# EAGLE design esp8285-programmer-v1.0 (EAGLE 7.5.0)
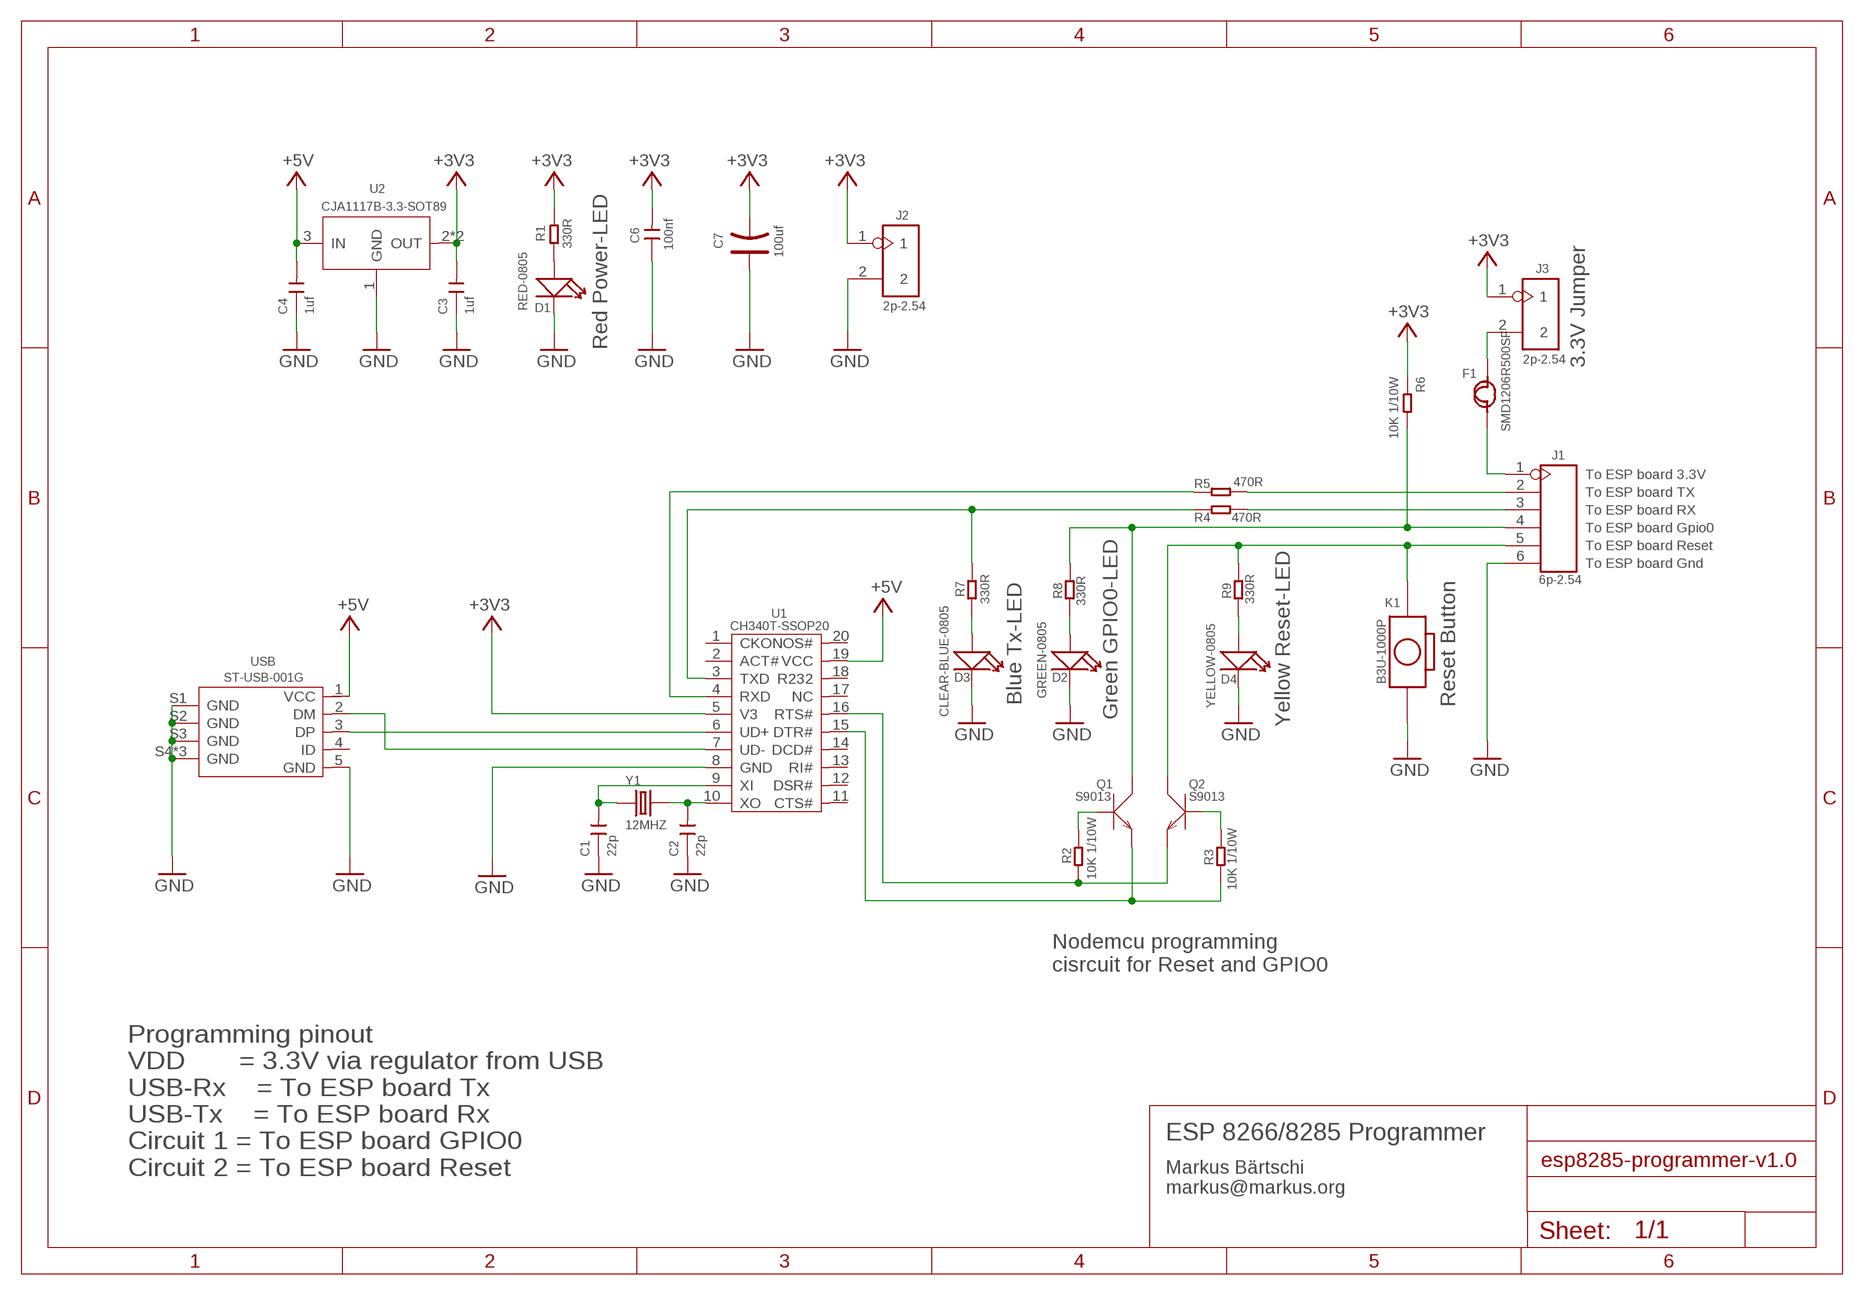
[diagram p0: schematic, sheet 1]

## Parts
C1  22p  CERAMIC-10PF-50V-5%-NPO(0603)  [C0603]
C2  22p  CERAMIC-10PF-50V-5%-NPO(0603)  [C0603]
C3  1uf  CERAMIC-1UF-25V-10%-X7R(0603)  [C0603]
C4  1uf  CERAMIC-1UF-25V-10%-X7R(0603)  [C0603]
C6  100nf  CERAMIC-100NF-50V-10%-X7R(0603)  [C0603]
C7  100uf  TANTALUM-SMD-100UF-6.3V(AVX-B)  [AVX-B]
D1  RED-0805  SMD-LED-CLEAR-RED(0805)  [LED-0805]
D2  GREEN-0805  SMD-LED-CLEAR-GREEN(0805)  [LED-0805]
D3  CLEAR-BLUE-0805  SMD-LED-CLEAR-BLUE(0805)  [LED-0805]
D4  YELLOW-0805  SMD-LED-CLEAR-YELLOW(0805)  [LED-0805]
F1  SMD1206R500SF  SMD-PPTC-500MA(1206)  [F1206]
J1  6p-2.54  DIP-BLACK-MALE-HEADER(6P-2.54)  [H6-2.54]
J2  2p-2.54  DIP-BLACK-MALE-HEADER-VERT(2P-2.54)  [H2-2.54]
J3  2p-2.54  DIP-BLACK-MALE-HEADER-VERT(2P-2.54)  [H2-2.54]
K1  B3U-1000P  SMD-BUTTON-WITHOUT-BOSS-(2P-3X2.5MM)  [SW2-SMD-3.0X2.5X1.2+0.4MM]
Q1  S9013  SMD-TRANSISTORS-NPN-25V-500MA-S9013(SOT-23)  [SOT-23]
Q2  S9013  SMD-TRANSISTORS-NPN-25V-500MA-S9013(SOT-23)  [SOT-23]
R1  330R  SMD-RES-330R-1%-1/10W(0603)  [R0603]
R2  10K 1/10W  SMD-RES-10K-5%-1/10W(0603)  [R0603]
R3  10K 1/10W  SMD-RES-10K-5%-1/10W(0603)  [R0603]
R4  470R  SMD-RES-470R-5%-1/10W(0603)  [R0603]
R5  470R  SMD-RES-470R-5%-1/10W(0603)  [R0603]
R6  10K 1/10W  SMD-RES-10K-5%-1/10W(0603)  [R0603]
R7  330R  SMD-RES-330R-1%-1/10W(0603)  [R0603]
R8  330R  SMD-RES-330R-1%-1/10W(0603)  [R0603]
R9  330R  SMD-RES-330R-1%-1/10W(0603)  [R0603]
U1  CH340T-SSOP20  INTERFACE-CH340T(SSOP20)  [SSOP20-0.65-7.6X5.2MM]
U2  CJA1117B-3.3-SOT89  PMIC-CJA1117B-3.3(SOT-89)  [SOT-89]
USB  ST-USB-001G  MICRO-USB-SMD-B-WITHOUT-POST-W/P(ST-USB-001G)  [MICRO-USB5+4P-SMD-0.65-B]
Y1  12MHZ  SMD-CRYSTAL-12MHZ-20PF-20PPM-40R(2P-5.0X3.2MM)  [X2-SMD-5.0X3.2X1.3MM]

## Nets
+3V3: C3.2 C6.2 C7.- J2.1 J3.1 R1.2 R6.1 U1.5(V3) U2.2(OUT) U2.4(OUT)
+5V: C4.2 U1.19(VCC) U2.3(IN) USB.1(VCC)
GND: C1.1 C2.1 C3.1 C4.1 C6.1 C7.+ D1.- D2.- D3.- D4.- J1.6 J2.2 K1.1 U1.8(GND) U2.1(GND) USB.5(GND) USB.S1(GND) USB.S2(GND) USB.S3(GND) USB.S4(GND) USB.S5(GND) USB.S6(GND)
N$1: F1.1 J1.1
N$2: D1.+ R1.1
N$3: F1.2 J3.2
N$4: J1.2 R5.2
N$5: C2.2 U1.10(XO) Y1.2
N$6: C1.2 U1.9(XI) Y1.1
N$7: J1.3 R4.2
N$8: Q1.1(B) R2.1
N$9: Q2.1(B) R3.1
N$17: D3.+ R7.1
N$18: D2.+ R8.1
N$19: D4.+ R9.1
N$DTR: Q1.2(E) R3.2 U1.15(DTR#)
N$GPIO0: J1.4 Q1.3(C) R6.2 R8.2
N$RESET: J1.5 K1.2 Q2.3(C) R9.2
N$RTS: Q2.2(E) R2.2 U1.16(RTS#)
N$RX: R5.1 U1.4(RXD)
N$TX: R4.1 R7.2 U1.3(TXD)
N$USBD+: U1.6(UD+) USB.3(DP)
N$USBD-: U1.7(UD-) USB.2(DM)
Unconnected: U1.1(CKO) U1.2(ACT#) U1.11(CTS#) U1.12(DSR#) U1.13(RI#) U1.14(DCD#) U1.17(NC) U1.18(R232) U1.20(NOS#) USB.4(ID)

## Notes on the sheet
- Red Power-LED
- 3.3V Jumper
- To ESP board 3.3V
- To ESP board TX
- To ESP board RX
- To ESP board Gpio0
- To ESP board Reset
- To ESP board Gnd
- Blue Tx-LED | Reset Button
- Green GPIO0-LED
- Yellow Reset-LED
- Nodemcu programming
  cisrcuit for Reset and GPIO0
- ESP 8266/8285 Programmer
- Markus Bärtschi
  markus@markus.org
- Programming pinout
  VDD       = 3.3V via regulator from USB
  USB-Rx    = To ESP board Tx
  USB-Tx    = To ESP board Rx
  Circuit 1 = To ESP board GPIO0
  Circuit 2 = To ESP board Reset

## Library data of the parts
C1 C2 = Seeed-OPL-Capacitor:CERAMIC-10PF-50V-5%-NPO(0603): 302010097; VALUE: 10pf
C3 C4 = Seeed-OPL-Capacitor:CERAMIC-1UF-25V-10%-X7R(0603): 302010139; MPN: CC0603KRX7R8BB105
C6 = Seeed-OPL-Capacitor:CERAMIC-100NF-50V-10%-X7R(0603): 302010138; MPN: CC0603KRX7R9BB104
C7 = Seeed-OPL-Capacitor:TANTALUM-SMD-100UF-6.3V(AVX-B): 302020017; MPN: TAJB107M006RNJ
D1 = Seeed-OPL-Diode:SMD-LED-CLEAR-RED(0805): 304090046; MPN: 17-215SURC/S530-A2/TR8
D2 = Seeed-OPL-Diode:SMD-LED-CLEAR-GREEN(0805): 304090057; MPN: 17-215SYGC/S530-E2/TR8
D3 = Seeed-OPL-Diode:SMD-LED-CLEAR-BLUE(0805): 304090061; MPN: EL-17-215/BHC-AN1P2/3T
D4 = Seeed-OPL-Diode:SMD-LED-CLEAR-YELLOW(0805): 304090039; MPN: 17-215UYC/S530-A3/TR8
F1 = Seeed-OPL-fuse:SMD-PPTC-500MA(1206): 307010002; MPN: SMD1206R500SF
J1 = Seeed-OPL-Connector:DIP-BLACK-MALE-HEADER(6P-2.54): 320020078; MPN: P125-1106A1BS116A1
J2 J3 = Seeed-OPL-Connector:DIP-BLACK-MALE-HEADER-VERT(2P-2.54): 320020016; MPN: P125-1102A0BS116A1
K1 = Seeed-OPL-Button:SMD-BUTTON-WITHOUT-BOSS-(2P-3X2.5MM): 311020047; MPN: B3U-1000P
Q1 Q2 = Seeed-OPL-Transistor:SMD-TRANSISTORS-NPN-25V-500MA-S9013(SOT-23): 305010018; MPN: S9013
R1 R7-R9 = Seeed-OPL-Resistor:SMD-RES-330R-1%-1/10W(0603): 301010300; MPN: RC0603FR-07330RL
R2 R3 R6 = Seeed-OPL-Resistor:SMD-RES-10K-5%-1/10W(0603): 301010293; MPN: RC0603JR-0710KL
R4 R5 = Seeed-OPL-Resistor:SMD-RES-470R-5%-1/10W(0603): 301010088; MPN: RC0603JR-07470RL
U1 = Seeed-OPL-ic:INTERFACE-CH340T(SSOP20): 310070026; MPN: CH340T
U2 = Seeed-OPL-ic:PMIC-CJA1117B-3.3(SOT-89): 310030095; MPN: CJA1117B-3.3
USB = Seeed-OPL-Connector:MICRO-USB-SMD-B-WITHOUT-POST-W/P(ST-USB-001G): 320010000; MPN: ST-USB-001G
Y1 = Seeed-OPL-Crystal-Oscillator:SMD-CRYSTAL-12MHZ-20PF-20PPM-40R(2P-5.0X3.2MM): 306010047; MPN: 5032/2P

## Board
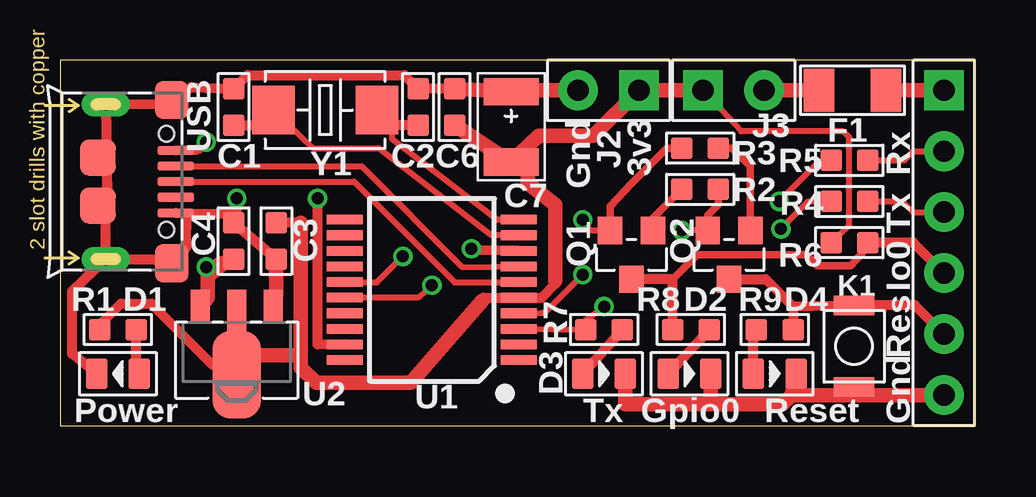
[diagram p1: board, top side]
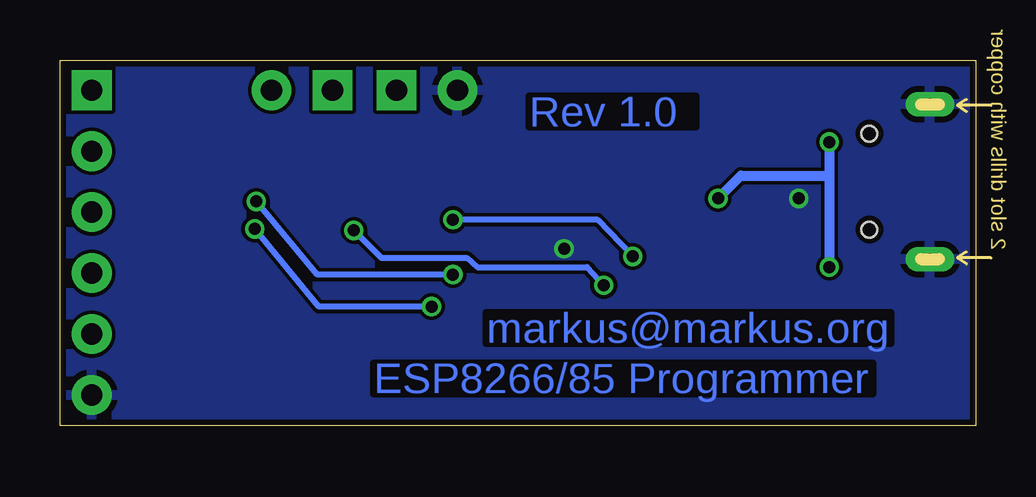
[diagram p2: board, bottom side, seen from below]

Size 38.15 x 15.23 mm. Coordinates in mm from the lower left corner, seen from the top.
Outline: 0,0 38.15,0 38.15,15.23 0,15.23 0,0
Copper layers (1*16): Top 0.035mm / dielectric 1.5mm / Bottom 0.035mm
Design rules "SeeedStudio_2layer_DRU_no_angle_20140221": minimum track width 6mil, minimum drill 12mil, track to track 6mil, track to pad 6mil, pad to pad 6mil, via to via 6mil, smd to smd 0mil, copper to edge 10mil, drill to drill 10mil, minimum pad ring 10mil, minimum via ring 6mil, stop-mask expansion 2mil, vias tented up to drill 100mil, thermal gap 10mil

### Footprints (pad centres in the part's own frame; a part is rotated, then mirrored left to right if it is on the bottom)
C0603 = smd 0.889 x 0.889: 1 0,0.762; 2 0,-0.762
AVX-B = smd 1.143 x 2.286: + -1.46,0; - 1.46,0
LED-0805 = smd 0.889 x 1.27: + -0.889,0; - 0.889,0
F1206 = smd 1.27 x 1.778: 1 -1.397,0; 2 1.397,0
H6-2.54 = drill 0.889 pad 1.651 square: 1 0,6.35 | drill 0.889 pad 1.651: 2 0,3.81; 3 0,1.27; 4 0,-1.27; 5 0,-3.81; 6 0,-6.35
H2-2.54 = drill 0.889 pad 1.651 square: 1 0,1.27 | drill 0.889 pad 1.651: 2 0,-1.27
SW2-SMD-3.0X2.5X1.2+0.4MM = smd 0.8 x 1.7: 1 -1.7,0; 2 1.7,0
SOT-23 = smd 1.016 x 1.143: 1 -0.889,-1.016; 2 0.889,-1.016; 3 0,1.016
R0603 = smd 0.889 x 0.889: 1 0,0.762; 2 0,-0.762
SSOP20-0.65-7.6X5.2MM = smd 0.4 x 1.5: 1 -2.925,-3.625; 2 -2.275,-3.625; 3 -1.625,-3.625; 4 -0.975,-3.625; 5 -0.325,-3.625; 6 0.325,-3.625; 7 0.975,-3.625; 8 1.625,-3.625; 9 2.275,-3.625; 10 2.925,-3.625; 11 2.925,3.625; 12 2.275,3.625; 13 1.625,3.625; 14 0.975,3.625; 15 0.325,3.625; 16 -0.325,3.625; 17 -0.975,3.625; 18 -1.625,3.625; 19 -2.275,3.625; 20 -2.925,3.625
SOT-89 = smd 0.8 x 1.4: 1 -1.524,-1.905; 3 1.524,-1.905 | smd 0.8 x 1.9: 2 0,-1.651 | smd 2.032 x 3.65: 4 0,0.94
MICRO-USB5+4P-SMD-0.65-B = smd 0.381 x 1.524: 1 -1.3,-0.25; 2 -0.65,-0.25; 3 0,-0.25; 4 0.65,-0.25; 5 1.3,-0.25 | smd 1.6 x 1.397: S1 -3.4,-0.427; S6 3.4,-0.427 | drill 0.508 pad 1.016 long: S2 -3.226,-3.175; S5 3.226,-3.175 | smd 1.5 x 1.5: S3 -1,-3.5; S4 1,-3.5 | hole 0.635: -2,-0.65; 2,-0.65
X2-SMD-5.0X3.2X1.3MM = smd 1.778 x 2.032: 1 -2.159,0; 2 2.159,0

### Placement (x,y rotation side)
C1  7.24,13.27 0 top
C2  14.92,13.27 0 top
C3  9.02,7.68 180 top
C4  7.24,7.68 0 top
C6  16.45,13.27 0 top
C7  18.8,12.45 270 top
D1  2.41,2.16 180 top
D2  26.23,2.16 0 top
D3  22.67,2.16 0 top
D4  29.78,2.16 0 top
F1  33.02,13.97 180 top
J1  36.83,7.62 0 top
J2  22.86,13.97 270 top
J3  28.07,13.97 90 top
K1  33.08,3.3 90 top
Q1  23.81,7.11 180 top
Q2  27.88,7.11 180 top
R1  2.41,4 270 top
R2  26.67,9.84 90 top
R3  26.67,11.56 270 top
R4  32.89,9.33 90 top
R5  32.89,11.05 90 top
R6  32.89,7.62 90 top
R7  22.67,4 270 top
R8  26.29,4 270 top
R9  29.78,4 90 top
U1  15.49,5.65 90 top
U2  7.37,3.05 180 top
USB  5.08,10.16 270 top
Y1  11.05,13.14 0 top

### Tracks (layer width: path | path; a pad name or v marks a point on that pad's centre or on a via)
+3V3
  Top 0.254: R6.1 32.89,8.32 32.89,12 32.64,12.26 28.38,12.26 J3.1
  Top 0.406: R1.2 1.65,4.19 2.54,5.08 3.81,5.08 6.35,2.54 U2.4 | 20.64,6.03 20.64,5.91 20.07,5.33 U1.5 17.65,5.33 17.59,5.27 17.59,5.21 | 19.49,10.79 C7.- 18.73,10.99 | 10.03,8.45 C3.2
  Top 0.61: 7.37,2.92 U2.4 | U2.2 7.37,2.92 | 7.37,2.92 10.03,2.92 | 10.03,2.92 10.03,8.45 | 20.64,6.03 20.64,9.21 19.49,10.1 19.49,10.79 | 18.73,10.99 C6.2 | C7.- 19.94,12.06 22.23,12.06 J2.1 J3.1 | 10.03,2.92 10.03,2.41 10.67,1.78 14.61,1.78 17.59,5.21
+5V  (via drill 0.5)
  Top 0.406: USB.1 5.71,11.49 v6.1,11.81 | v6.1,6.6 6.73,6.86 6.67,6.67 C4.2 | U1.19 10.73,3.37 v10.73,9.46
  Top 0.61: U2.3 6.16,5.33 6.16,6.22 6.67,6.67
  Bottom 0.406: v6.1,11.81 6.1,10.41 | 6.1,10.41 v6.1,6.6 | v10.73,9.46 9.78,10.41 6.1,10.41
GND  (via drill 0.5)
  Top 0.406: D1.- 0.51,2.98 0.51,5.59 USB.S5 | USB.S5 3.87,6.92 USB.S6 5.27,7.43 5.28,8.84 | USB.S5 1.91,8.45 USB.S4 1.97,9.53 | 1.97,9.53 USB.S2 4,13.4 USB.S1 5.46,14.1 C1.1 7.81,14.61 14.35,14.61 C2.1 C6.1 | 1.97,9.53 1.97,10.41 USB.S3 | 19.37,13.97 C7.+ 18.73,13.91 | USB.5 5.28,8.84 | 5.28,8.84 7.37,8.83 | C3.1 C4.1 7.37,8.83 | U1.8 17.21,7.3 v17.14,7.37 | 7.37,8.83 v7.37,9.46
  Top 0.61: C3.1 9.02,5.46 U2.1 | J2.2 19.37,13.97 | 18.73,13.91 C6.1 | J1.6 33.02,1.27 | 33.02,1.27 30.48,1.27 | 30.48,1.27 D4.- | K1.1 33.02,1.27 | 30.48,1.27 30.1,0.89 27.11,0.89 | 27.11,0.89 D2.- | D3.- 23.56,0.89 27.11,0.89
  Bottom 0.406: v17.14,7.37 17.34,7.3 | v7.37,9.46 7.3,9.46
  pour Bottom: 0.25,14.99 37.91,14.99 37.91,0.25 0.25,0.25
N$1
  Top 0.61: F1.1 J1.1
N$2
  Top 0.406: D1.+ 3.17,2.16 R1.1
N$3
  Top 0.61: J3.2 F1.2
N$4
  Top 0.254: R5.2 35.18,11.05 35.56,11.43 J1.2
N$5
  Top 0.254: U1.10 18.22,8.57 13.84,11.94 13.84,12.57 13.26,12.55
  Top 0.406: C2.2 13.72,12.51 13.26,12.55 Y1.2
N$6
  Top 0.254: Y1.1 10.54,11.56 13.27,11.56 17.97,7.94 U1.9
  Top 0.406: C1.2 8.26,12.51 Y1.1
N$7
  Top 0.254: R4.2 35.12,9.34 35.56,8.89 J1.3
N$8
  Top 0.305: R2.1 24.7,8.64 Q1.1
N$9
  Top 0.305: Q2.1 28.77,10.79 28,11.56 R3.1
N$17
  Top 0.406: D3.+ R7.1
N$18
  Top 0.406: D2.+ R8.1
N$19
  Top 0.406: D4.+ 28.89,3.49 R9.1
N$DTR  (via drill 0.5)
  Top 0.254: U1.15 13.21,5.97 v14.29,7.05 | v21.78,8.57 22.1,8.13 Q1.2
  Top 0.305: R3.2 25.27,11.56 23.81,10.1 22.92,9.14 Q1.2
  Bottom 0.254: v14.29,7.05 15.75,8.57 v21.78,8.57
N$GPIO0
  Top 0.305: 25.53,6.1 26.54,7.11 31.11,7.11 31.56,6.67 32.96,6.67 33.53,7.3 R6.2
  Top 0.406: J1.4 35.56,7.62 R6.2 | R8.2 25.53,6.1 Q1.3
N$RESET
  Top 0.406: J1.5 35.62,5.02 K1.2 30.54,4.95 | 30.54,4.95 R9.2 | Q2.3 29.4,6.1 30.54,4.95
N$RTS  (via drill 0.5)
  Top 0.254: Q2.2 v25.91,8.13 | v15.49,5.84 14.92,5.33 U1.16
  Top 0.305: R2.2 27.43,9.21 26.99,8.76 Q2.2
  Bottom 0.254: v25.91,8.13 24.77,6.99 21.21,6.99 20.77,6.6 16.19,6.6 v15.49,5.84
N$RX  (via drill 0.5)
  Top 0.254: U1.4 20.13,4.7 20.19,4.7 v21.78,6.29 | v29.97,9.34 31.62,10.99 32.07,10.99 R5.1
  Bottom 0.254: v21.78,6.29 27.43,6.29 v29.97,9.34
N$TX  (via drill 0.5)
  Top 0.254: U1.3 R7.2 21.91,4.38 v22.67,4.95 | v30.04,8.19 31.18,9.34 R4.1
  Bottom 0.254: v22.67,4.95 27.37,4.95 v30.04,8.19
N$USBD+
  Top 0.254: USB.3 12.26,10.16 16.45,5.97 U1.6
N$USBD-
  Top 0.254: USB.2 12.57,10.79 16.76,6.6 U1.7

### Text on the board
Bottom: Rev 1.0 | markus@markus.org | ESP8266/85 Programmer
tNames: Gnd | 3v3 | Rx | Tx | Io0 | Res | Power | Tx | Gpio0 | Reset | Gnd